# EAGLE schematic Genus_MainBoard_Lite-v.1.0 (EAGLE 9.4.2)
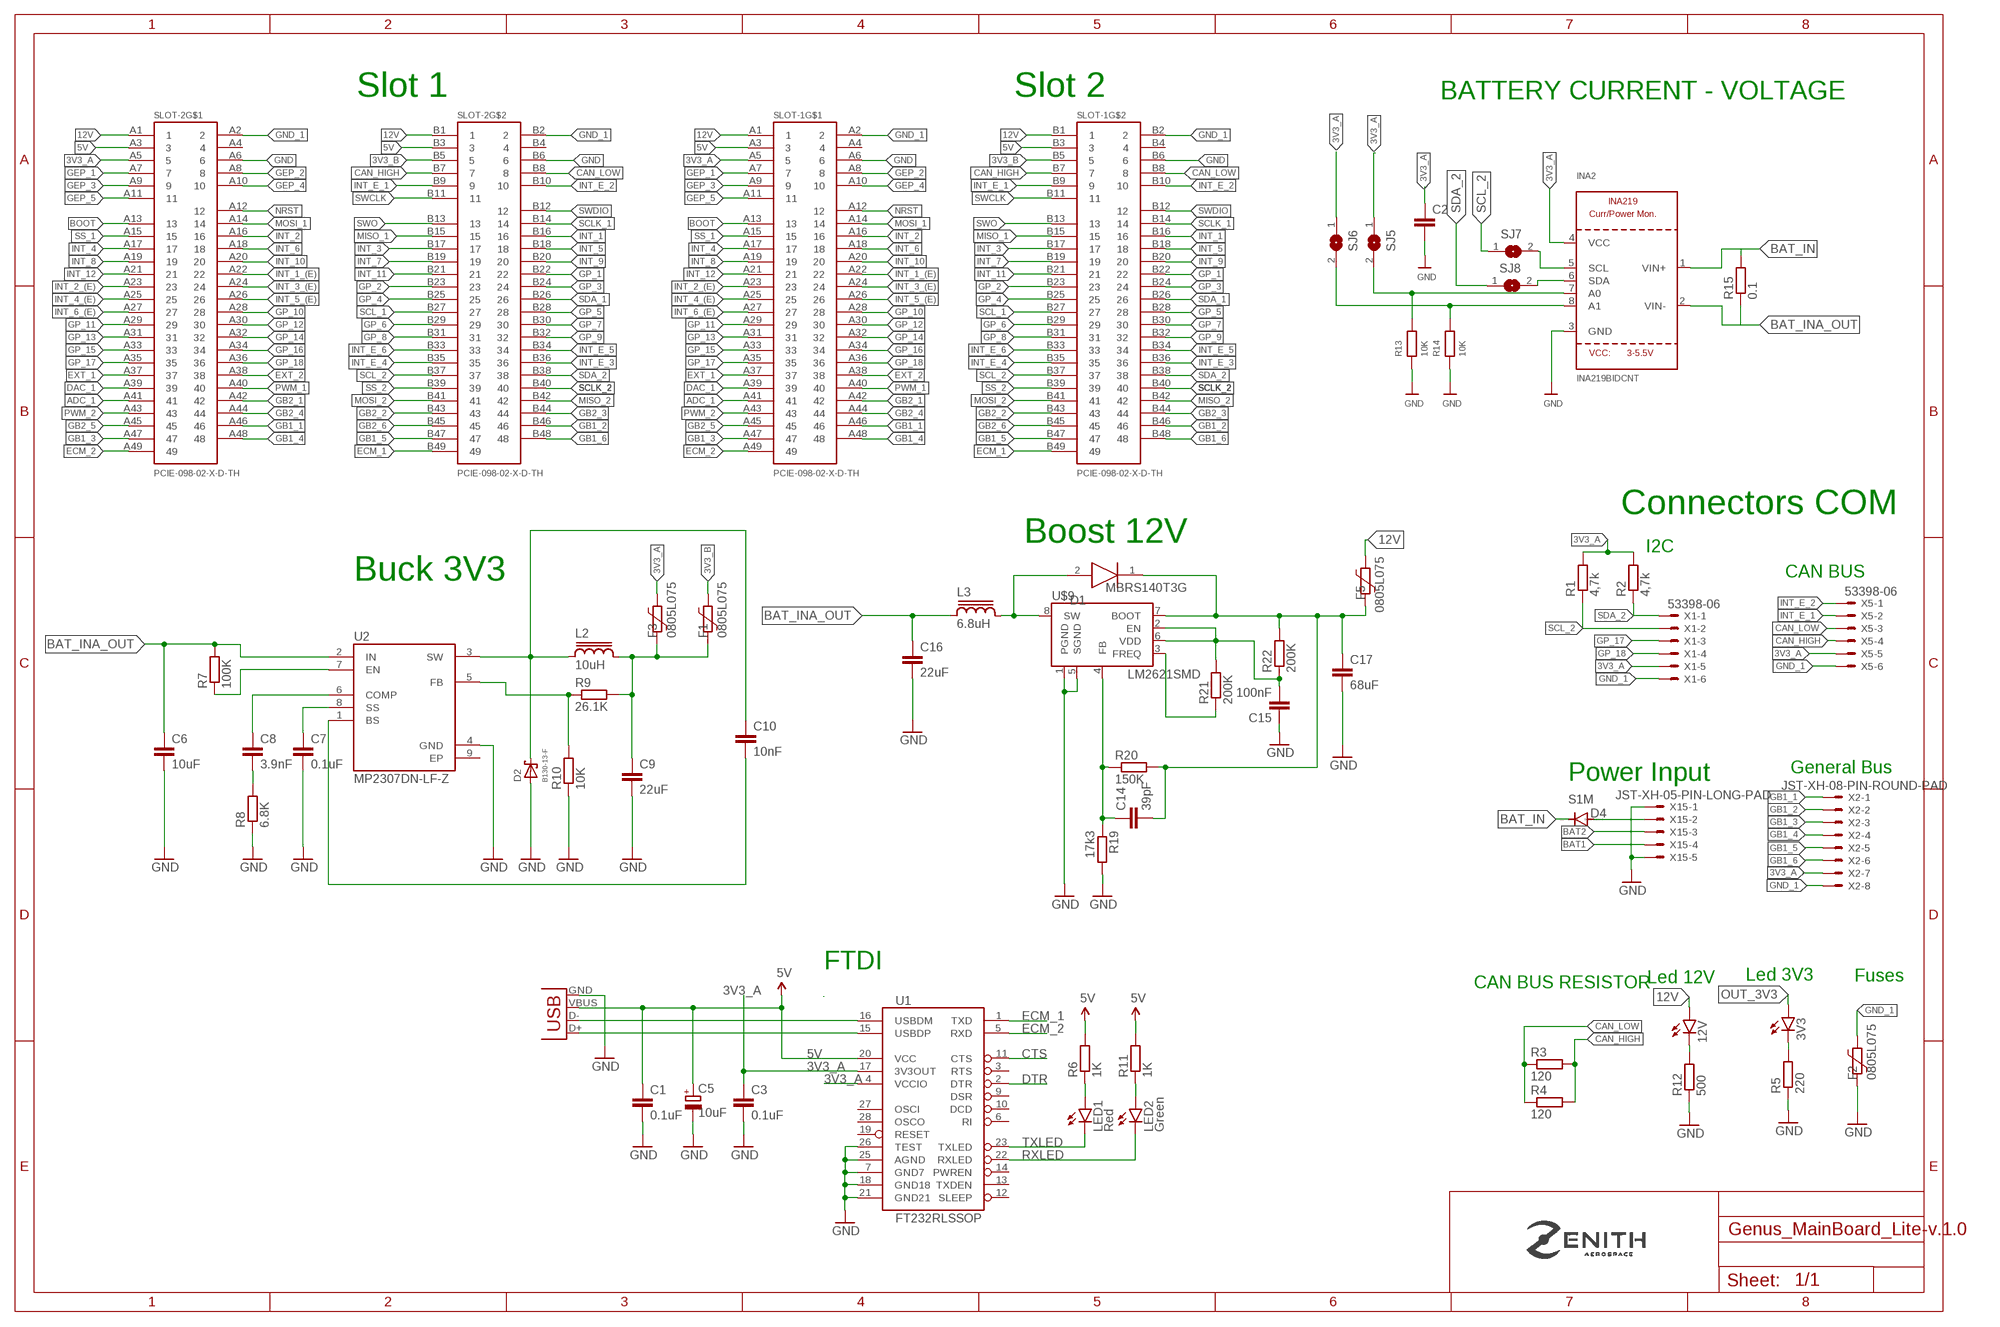
[diagram p0: schematic, sheet 1]

## Parts
3V3  LEDCHIP-LED0805  [CHIP-LED0805]
12V  LEDCHIP-LED0805  [CHIP-LED0805]
C1  0.1uF  C-EUC0805  [C0805]
C2  C-EUC0805  [C0805]
C3  0.1uF  C-EUC0805  [C0805]
C5  10uF  CPOL-EUB  [PANASONIC_B]
C6  10uF  C-EUC0805  [C0805]
C7  0.1uF  C-EUC0805  [C0805]
C8  3.9nF  C-EUC0805  [C0805]
C9  22uF  C-EUC0805  [C0805]
C10  10nF  C-EUC0805  [C0805]
C14  39pF  C-EUC0805  [C0805]
C15  100nF  C-EUC0805  [C0805]
C16  22uF  C-EUC1210  [C1210]
C17  68uF  C-EUC1210  [C1210]
D1  MBRS140T3G  [DIOM5436X247N]
D2  B130-13-F  [SMA]
D4  S1M  [SMA]
F1  0805L075  [0805L]
F2  0805L075  [0805L]
F3  0805L075  [0805L]
F5  0805L075  [0805L]
INA2  INA219BIDCNT  INA219  [SOT23-8]
L2  10uH  SRR1280  [SRR1280]
L3  6.8uH  SRR1280  [SRR1280]
LED1  Red  LEDCHIPLED_0805  [CHIPLED_0805]
LED2  Green  LEDCHIPLED_0805  [CHIPLED_0805]
R1  4,7k  R-EU_R0805  [R0805]
R2  4,7k  R-EU_R0805  [R0805]
R3  120  R-EU_R0805  [R0805]
R4  120  R-EU_R0805  [R0805]
R5  220  R-EU_R0805  [R0805]
R6  1K  R-EU_R0805  [R0805]
R7  100K  R-EU_R0805  [R0805]
R8  6.8K  R-EU_R0805  [R0805]
R9  26.1K  R-EU_R0805  [R0805]
R10  10K  R-EU_R0805  [R0805]
R11  1K  R-EU_R0805  [R0805]
R12  500  R-EU_R0805  [R0805]
R13  10K  R-EU_R0805  [R0805]
R14  10K  R-EU_R0805  [R0805]
R15  0.1  R-EU_R2512  [R2512]
R19  17k3  R-EU_R0805  [R0805]
R20  150K  R-EU_R0805  [R0805]
R21  200K  R-EU_R0805  [R0805]
R22  200K  R-EU_R0805  [R0805]
SJ5  SOLDERJUMPERREFLOW_NOPASTE  [SOLDERJUMPER_REFLOW_NOPASTE]
SJ6  SOLDERJUMPERREFLOW_NOPASTE  [SOLDERJUMPER_REFLOW_NOPASTE]
SJ7  SOLDERJUMPERREFLOW_NOPASTE  [SOLDERJUMPER_REFLOW_NOPASTE]
SJ8  SOLDERJUMPERREFLOW_NOPASTE  [SOLDERJUMPER_REFLOW_NOPASTE]
SLOT-1  PCIE-098-02-X-D-TH  [PCIE-098-02-X-D-TH]
SLOT-2  PCIE-098-02-X-D-TH  [PCIE-098-02-X-D-TH]
U1  FT232RLSSOP  [SSOP28DB]
U2  MP2307DN-LF-Z  [SOIC127P600X170-9N]
U$9  LM2621SMD  [MSOP-8]
X1  53398-06  [53398-06]
X2  JST-XH-08-PIN-ROUND-PAD  [JST-XH-08-PACKAGE-ROUND-PAD]
X3  USB-SMD-NS  [USB-MINIB-NOSTOP]
X5  53398-06  [53398-06]
X15  JST-XH-05-PIN-LONG-PAD  [JST-XH-05-PACKAGE-LONG-PAD]

## Nets
3V3_A: C2.1 C3.1 F3.1 INA2.4(VCC) R1.2 R2.2 SJ5.1 SJ6.1 SLOT-1.A5 SLOT-2.A5 U1.4(VCCIO) U1.17(3V3OUT) X1.5 X2.7 X5.5
3V3_B: F1.1 SLOT-1.B5 SLOT-2.B5
5V: C1.1 C5.+ R6.2 R11.2 SLOT-1.A3 SLOT-1.B3 SLOT-2.A3 SLOT-2.B3 U1.20(VCC) X3.VBUS
12V: 12V.A F5.1 SLOT-1.A1 SLOT-1.B1 SLOT-2.A1 SLOT-2.B1
ADC_1: SLOT-1.A41 SLOT-2.A41
BAT1: X15.4
BAT2: X15.3
BAT_IN: D4.C INA2.1(VIN+) R15.2
BAT_INA_OUT: C6.1 C16.1 INA2.2(VIN-) L3.1 R7.2 R15.1 U2.2(IN)
BOOT: SLOT-1.A13 SLOT-2.A13
CAN_HIGH: R3.2 R4.2 SLOT-1.B7 SLOT-2.B7 X5.4
CAN_LOW: R3.1 R4.1 SLOT-1.B8 SLOT-2.B8 X5.3
CTS: U1.11(CTS)
DAC_1: SLOT-1.A39 SLOT-2.A39
DTR: U1.2(DTR)
ECM_1: SLOT-1.B49 SLOT-2.B49 U1.1(TXD)
ECM_2: SLOT-1.A49 SLOT-2.A49 U1.5(RXD)
EXT_1: SLOT-1.A37 SLOT-2.A37
EXT_2: SLOT-1.A38 SLOT-2.A38
GB1_1: SLOT-1.A46 SLOT-2.A46 X2.1
GB1_2: SLOT-1.B46 SLOT-2.B46 X2.2
GB1_3: SLOT-1.A47 SLOT-2.A47 X2.3
GB1_4: SLOT-1.A48 SLOT-2.A48 X2.4
GB1_5: SLOT-1.B47 SLOT-2.B47 X2.5
GB1_6: SLOT-1.B48 SLOT-2.B48 X2.6
GB2_1: SLOT-1.A42 SLOT-2.A42
GB2_2: SLOT-1.B43 SLOT-2.B43
GB2_3: SLOT-1.B44 SLOT-2.B44
GB2_4: SLOT-1.A44 SLOT-2.A44
GB2_5: SLOT-1.A45 SLOT-2.A45
GB2_6: SLOT-1.B45 SLOT-2.B45
GEP_1: SLOT-1.A7 SLOT-2.A7
GEP_2: SLOT-1.A8 SLOT-2.A8
GEP_3: SLOT-1.A9 SLOT-2.A9
GEP_4: SLOT-1.A10 SLOT-2.A10
GEP_5: SLOT-1.A11 SLOT-2.A11
GND: C1.2 C2.2 C3.2 C5.- C6.2 C7.2 C9.2 C15.1 C16.2 C17.2 D2.A F2.2 INA2.3(GND) R5.1 R8.1 R10.1 R12.1 R13.1 R14.1 R19.2 SLOT-1.A6 SLOT-1.B6 SLOT-2.A6 SLOT-2.B6 U1.7(GND7) U1.18(GND18) U1.21(GND21) U1.25(AGND) U1.26(TEST) U2.4(GND) U$9.1(PGND) U$9.5(SGND) X3.GND X15.1 X15.5
GND_1: F2.1 SLOT-1.A2 SLOT-1.B2 SLOT-2.A2 SLOT-2.B2 X1.6 X2.8 X5.6
GP_1: SLOT-1.B22 SLOT-2.B22
GP_2: SLOT-1.B23 SLOT-2.B23
GP_3: SLOT-1.B24 SLOT-2.B24
GP_4: SLOT-1.B25 SLOT-2.B25
GP_5: SLOT-1.B28 SLOT-2.B28
GP_6: SLOT-1.B29 SLOT-2.B29
GP_7: SLOT-1.B30 SLOT-2.B30
GP_8: SLOT-1.B31 SLOT-2.B31
GP_9: SLOT-1.B32 SLOT-2.B32
GP_10: SLOT-1.A28 SLOT-2.A28
GP_11: SLOT-1.A29 SLOT-2.A29
GP_12: SLOT-1.A30 SLOT-2.A30
GP_13: SLOT-1.A31 SLOT-2.A31
GP_14: SLOT-1.A32 SLOT-2.A32
GP_15: SLOT-1.A33 SLOT-2.A33
GP_16: SLOT-1.A34 SLOT-2.A34
GP_17: SLOT-1.A35 SLOT-2.A35 X1.3
GP_18: SLOT-1.A36 SLOT-2.A36 X1.4
INT_1: SLOT-1.B16 SLOT-2.B16
INT_1_(E): SLOT-1.A22 SLOT-2.A22
INT_2: SLOT-1.A16 SLOT-2.A16
INT_2_(E): SLOT-1.A23 SLOT-2.A23
INT_3: SLOT-1.B17 SLOT-2.B17
INT_3_(E): SLOT-1.A24 SLOT-2.A24
INT_4: SLOT-1.A17 SLOT-2.A17
INT_4_(E): SLOT-1.A25 SLOT-2.A25
INT_5: SLOT-1.B18 SLOT-2.B18
INT_5_(E): SLOT-1.A26 SLOT-2.A26
INT_6: SLOT-1.A18 SLOT-2.A18
INT_6_(E): SLOT-1.A27 SLOT-2.A27
INT_7: SLOT-1.B19 SLOT-2.B19
INT_8: SLOT-1.A19 SLOT-2.A19
INT_9: SLOT-1.B20 SLOT-2.B20
INT_10: SLOT-1.A20 SLOT-2.A20
INT_11: SLOT-1.B21 SLOT-2.B21
INT_12: SLOT-1.A21 SLOT-2.A21
INT_E_1: SLOT-1.B9 SLOT-2.B9 X5.2
INT_E_2: SLOT-1.B10 SLOT-2.B10 X5.1
INT_E_3: SLOT-1.B36 SLOT-2.B36
INT_E_4: SLOT-1.B35 SLOT-2.B35
INT_E_5: SLOT-1.B34 SLOT-2.B34
INT_E_6: SLOT-1.B33 SLOT-2.B33
MISO_1: SLOT-1.B15 SLOT-2.B15
MISO_2: SLOT-1.B42 SLOT-2.B42
MOSI_1: SLOT-1.A14 SLOT-2.A14
MOSI_2: SLOT-1.B41 SLOT-2.B41
N$1: LED1.A R6.1
N$2: LED2.A R11.1
N$3: 12V.C R12.2
N$4: INA2.8(A1) R14.2 SJ6.2
N$6: D4.A X15.2
N$7: INA2.7(A0) R13.2 SJ5.2
N$8: R7.1 U2.7(EN)
N$9: C8.2 R8.2
N$10: C7.1 U2.8(SS)
N$11: C8.1 U2.6(COMP)
N$12: C10.1 D2.C L2.1 U2.3(SW)
N$13: R9.1 R10.2 U2.5(FB)
N$14: C10.2 U2.1(BS)
N$15: INA2.5(SCL) SJ7.2
N$16: INA2.6(SDA) SJ8.2
N$20: C14.1 R19.1 R20.1 U$9.4(FB)
N$21: D1.2(A) L3.2 U$9.8(SW)
N$22: C15.2 R21.2 R22.1 U$9.2(EN) U$9.6(VDD)
N$23: R21.1 U$9.3(FREQ)
N$37: 3V3.C R5.2
NRST: SLOT-1.A12 SLOT-2.A12
OUT: C14.2 C17.1 D1.1(K) F5.2 R20.2 R22.2 U$9.7(BOOT)
OUT_3V3: 3V3.A C9.1 F1.2 F3.2 L2.2 R9.2
PWM_1: SLOT-1.A40 SLOT-2.A40
PWM_2: SLOT-1.A43 SLOT-2.A43
RXLED: LED2.C U1.22(RXLED)
SCL_1: SLOT-1.B27 SLOT-2.B27
SCL_2: R1.1 SJ7.1 SLOT-1.B37 SLOT-2.B37 X1.2
SCLK_1: SLOT-1.B14 SLOT-2.B14
SCLK_2: SLOT-1.B40 SLOT-2.B40
SDA_1: SLOT-1.B26 SLOT-2.B26
SDA_2: R2.1 SJ8.1 SLOT-1.B38 SLOT-2.B38 X1.1
SS_1: SLOT-1.A15 SLOT-2.A15
SS_2: SLOT-1.B39 SLOT-2.B39
SWCLK: SLOT-1.B11 SLOT-2.B11
SWDIO: SLOT-1.B12 SLOT-2.B12
SWO: SLOT-1.B13 SLOT-2.B13
TXLED: LED1.C U1.23(TXLED)
USB_D+: U1.15(USBDP) X3.D+
USB_D-: U1.16(USBDM) X3.D-
Unconnected: SLOT-1.A4 SLOT-1.B4 SLOT-2.A4 SLOT-2.B4 U1.3(RTS) U1.6(RI) U1.9(DSR) U1.10(DCD) U1.12(SLEEP) U1.13(TXDEN) U1.14(PWREN) U1.19(RESET) U1.27(OSCI) U1.28(OSCO)

## Notes on the sheet
- Slot 1 | Slot 2 | BATTERY CURRENT - VOLTAGE
- Connectors COM
- Boost 12V
- I2C
- Buck 3V3 | CAN BUS
- General Bus
- Power Input
- FTDI
- Led 12V | Led 3V3 | Fuses
- CAN BUS RESISTOR
- C:/Users/marcu/Desktop/Ensino Superior/Graduação - Eng Elétrica/Zenith/zenith-v2.bmp

## Power pins joined to a net without a drawn wire
EP: U2.9(EP)

## Library data of the parts
3V3 12V LED1 LED2 = led:LED: LED OSRAM: - CHIPLED LG R971, LG N971, LY N971, LG Q971, LY Q971, LO R971, LY R971 LH N974, LH R974 LS Q976, LO Q976, LY Q976 LO Q996 - Hyper CHIPLED LW Q18S LB Q993, LB Q99A, LB R99A - SideLED LS A670, LO A670, LY A670, LG A670, LP A670 LB A673, LV A673, LT A673, LW A673 LH A674 LY A675 LS A676, LA A676, LO A676, LY A676, LW A676 LS A679, LY A679, LG A679 - Hyper Micro SIDELED® LS Y876, LA Y876, LO Y876, LY Y876 LT Y87S - SmartLED LW L88C, LW L88S LB L89C, LB L89S, LG L890 LS L89K, LO L89K, LY L89K LS L896, LA L896, LO L896, LY L896 - TOPLED LS T670, LO T670, LY T670, LG T670, LP T670 LSG T670, LSP T670, LSY T670, LOP T670, LYG T670 LG T671, LOG T671, LSG T671 LB T673, LV T673, LT T673, LW T673 LH T674 LS T676, LA T676, LO T676, LY T676, LB T676, LH T676, LSB T676, LW T676 LB T67C, LV T67C, LT T67C, LS T67K, LO T67K, LY T67K, LW E67C LS E67B, LA E67B, LO E67B, LY E67B, LB E67C, LV E67C, LT E67C LW T67C LS T679, LY T679, LG T679 LS T770, LO T770, LY T770, LG T770, LP T770 LB T773, LV T773, LT T773, LW T773 LH T774 LS E675, LA E675, LY E675, LS T675 LS T776, LA T776, LO T776, LY T776, LB T776 LHGB T686 LT T68C, LB T68C - Hyper Mini TOPLED® LB M676 - Mini TOPLED Santana® LG M470 LS M47K, LO M47K, LY M47K Source: http://www.osram.convergy.de LUXEON: - LUMILED® LXK2-PW12-R00, LXK2-PW12-S00, LXK2-PW14-U00, LXK2-PW14-V00 LXK2-PM12-R00, LXK2-PM12-S00, LXK2-PM14-U00 LXK2-PE12-Q00, LXK2-PE12-R00, LXK2-PE12-S00, LXK2-PE14-T00, LXK2-PE14-U00 LXK2-PB12-K00, LXK2-PB12-L00, LXK2-PB12-M00, LXK2-PB14-N00, LXK2-PB14-P00, LXK2-PB14-Q00 LXK2-PR12-L00, LXK2-PR12-M00, LXK2-PR14-Q00, LXK2-PR14-R00 LXK2-PD12-Q00, LXK2-PD12-R00, LXK2-PD12-S00 LXK2-PH12-R00, LXK2-PH12-S00 LXK2-PL12-P00, LXK2-PL12-Q00, LXK2-PL12-R00 Source: www.luxeon.com KINGBRIGHT: KA-3528ASYC Source: www.kingbright.com
C1-C3 C6-C10 C14-C17 = rcl:C-EU: CAPACITOR, European symbol; SPICEPREFIX: C
C5 = rcl:CPOL-EU: POLARIZED CAPACITOR, European symbol; SPICEPREFIX: C
D1 = MBRS140T3G:MBRS140T3G: Source: Datasheet <http://www.onsemi.com/pub/Collateral/MBRS140T3-D.PDF>; ALLIED_NUMBER: 70099505; ALLIED_PRICE/STOCK: http://www.alliedelec.com/on-semiconductor-mbrs140t3g/70099505/; ARROW_PART_NUMBER: MBRS140T3G; ARROW_PRICE/STOCK: https://www.arrow.com/en/products/mbrs140t3g/on-semiconductor; HEIGHT: 2.47mm; MANUFACTURER_NAME: ON Semiconductor; MANUFACTURER_PART_NUMBER: MBRS140T3G; RS_PART_NUMBER: 5452074P; RS_PRICE/STOCK: http://uk.rs-online.com/web/p/products/5452074P
D2 = B130-13-F:B130-13-F; AVAILABILITY: Unavailable; DESCRIPTION: Diode Schottky 30V 1A Surface Mount SMA; MF: Multicomp; MP: B130-13-F; PACKAGE: DO-214 Multicomp; PRICE: None
D4 = diode:S1M
F1-F3 F5 = polyfuse-smd_10:?: Polyfuse Resettable PTC Source: http://www.littelfuse.com/products/resettable-ptcs.aspx; MF: Littelfuse; MPN: 0805L075; OC_FARNELL: 1832105RL; OC_NEWARK: 18M4777
INA2 = microbuilder:INA219: INA219 - I2C Current/Power Monitor Voltage Range: 0-26V Accuracy: 0.5% Temperature: -40°C - 125°C
L2 L3 = inductor-bourns:SRR1280: POWER INDUCTOR
R1-R15 R19-R22 = rcl:R-EU_: RESISTOR, European symbol; SPICEPREFIX: R
SJ5-SJ8 = microbuilder:SOLDERJUMPER: SMD Solder JUMPER Solder the two pads together to create a connection, or remove the solder to break it. REFLOW - Use this footprint for solder paste and reflow ovens. WAVE - Use this footprint for hand-soldering (larger pads). CLOSED - Has a trace between the two pads to ensure it is closed by default. The trace needs to be cut to disable the jumper, and can be closed again by creating a solder bridge between the two pads.
SLOT-1 SLOT-2 = Z_BUS:PCIE-098-02-X-D-TH: PCI EXPRESS CARD CONNECTOR ,98 PINS.; AVAILABILITY: Unavailable; DESCRIPTION: 98 Position Female Connector PCI Express™ Gold 0.039 _1.00mm_ Black; MF: Samtec; MP: PCIE-098-02-F-D-TH; PACKAGE: None; PRICE: None
U1 = SparkFun:FT232RL: USB UART FT232RL 4th Generation USB UART (USB <-> Serial) Controller. Spark Fun Electronics SKU : COM-00650
U2 = MP2307DN-LF-Z:MP2307DN-LF-Z: MP2307 Series 23 V 3 A 380 KHz Synchronous Rectified Step-Down Converter-SOIC-8; AVAILABILITY: Unavailable; DESCRIPTION: Buck Switching Regulator IC Positive Adjustable 0.925V 1 Output 3A 8-SOIC _0.154, 3.90mm Width_ Exposed Pad; MF: Monolithic Power; MP: MP2307DN-LF-Z; PACKAGE: SOIC-8 Monolithic Power; PRICE: None
U$9 = SparkFun-PowerIC:LM2621: Step-up switching regulator IC
X1 X5 = con-zenith:53?-06: CONNECTOR wire to board 1.25 mm (.049 inch) pitch header; MF: MOLEX; OC_FARNELL: 1125368; OC_NEWARK: unknown
X2 = JST-XH-Zenith:JST-XH-08-PIN: JST XH Connector 2 Pin Wire to board connector. Pitch: 2,54 mm, (0.100") Number of pins: 8 Created by Rembrandt Electronics www.rembrandtelectronics.com
X3 = SparkFun:USB: USB Connectors USB-B-PTH is fully proven SKU : PRT-00139 USB-miniB is fully proven SKU : PRT-00587 USB-A-PCB is untested. USB-A-H is throughly reviewed, but untested. Spark Fun Electronics SKU : PRT-00437 USB-B-SMT is throughly reviewed, but untested. Needs silkscreen touching up. USB-A-S has not been used/tested USB-MB-H has not been used/tested
X15 = JST-XH-Zenith:JST-XH-05-PIN: JST XH Connector 2 Pin Wire to board connector. Pitch: 2,54 mm, (0.100") Number of pins: 5 Created by Rembrandt Electronics www.rembrandtelectronics.com

## Net classes
1 power: width 0.254 mm